# EAGLE schematic stmdc (EAGLE 7.2.0)
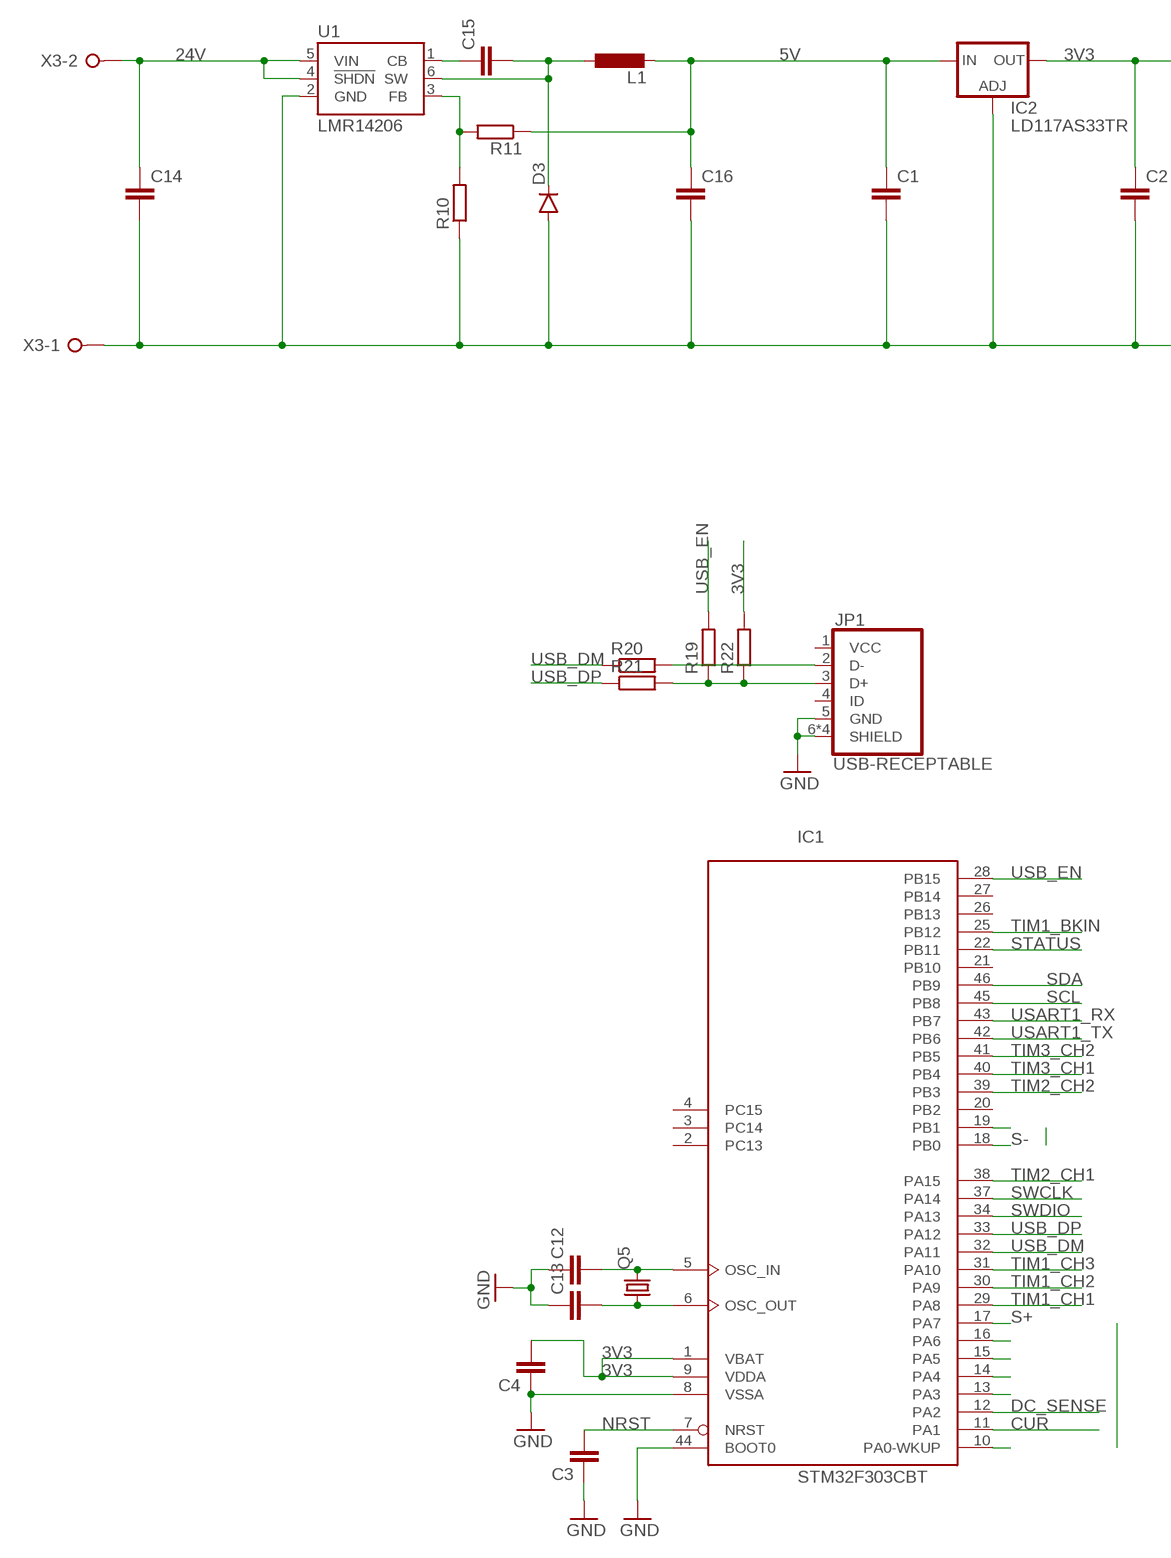
[diagram p0: schematic, sheet 1, part 1 of 2]
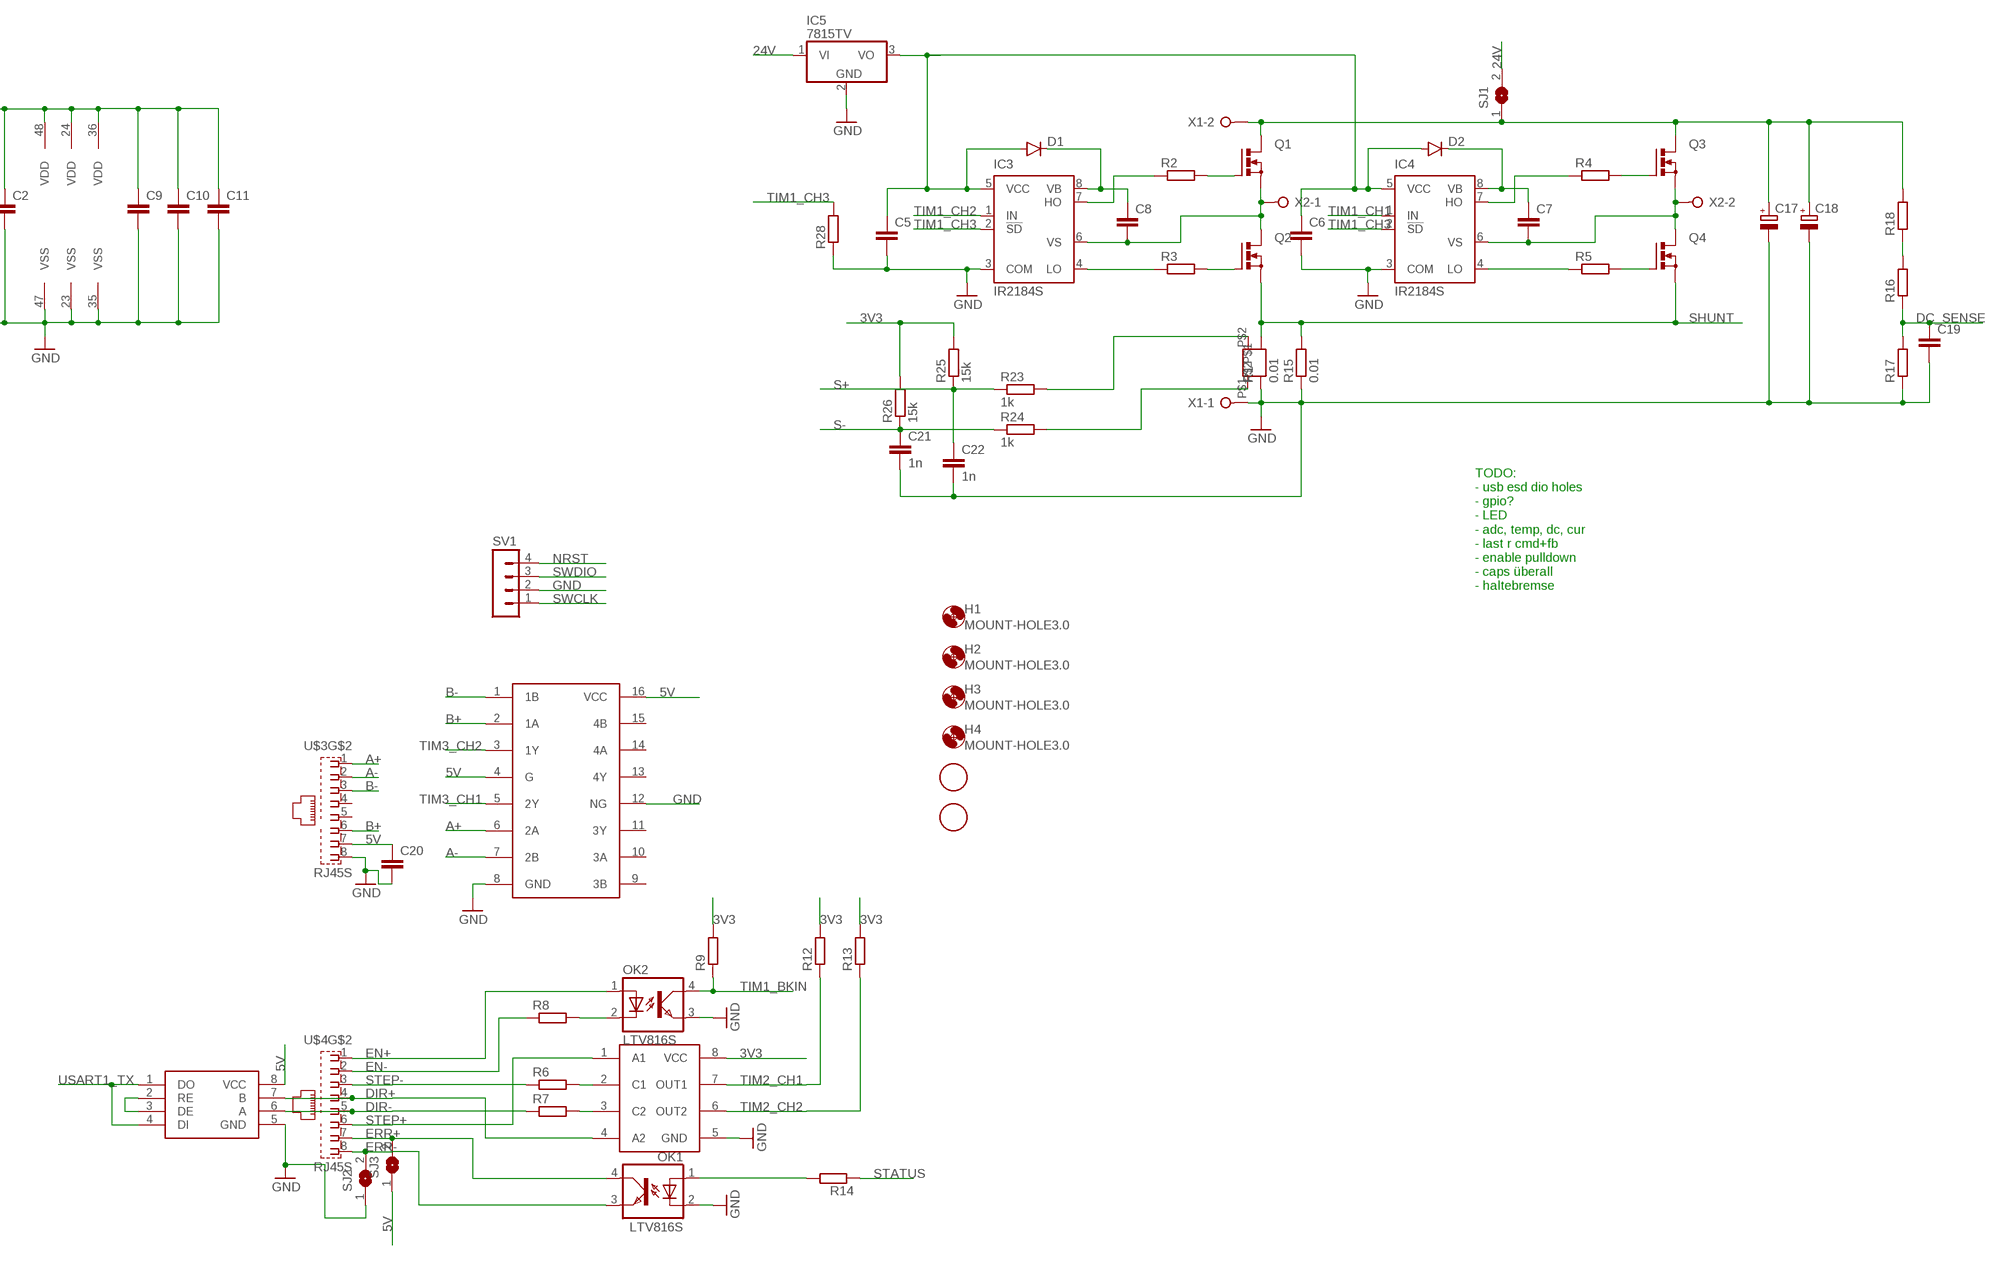
[diagram p1: schematic, sheet 1, part 2 of 2]

## Parts
C1  C-EUC0805  [C0805]
C2  C-EUC0805  [C0805]
C3  C-EUC0603  [C0603]
C4  C-EUC0603  [C0603]
C5  C-EUC0603  [C0603]
C6  C-EUC0603  [C0603]
C7  C-EUC0805  [C0805]
C8  C-EUC0805  [C0805]
C9  C-EUC0603  [C0603]
C10  C-EUC0603  [C0603]
C11  C-EUC0603  [C0603]
C12  C-EUC0603  [C0603]
C13  C-EUC0603  [C0603]
C14  C-EUC1210  [C1210]
C15  C-EUC0805  [C0805]
C16  C-EUC1210  [C1210]
C17  CPOL-EUTT5D11L  [TT5D11L]
C18  CPOL-EUTT5D11L  [TT5D11L]
C19  C-EUC0603  [C0603]
C20  C-EUC0603  [C0603]
C21  1n  C-EUC0603  [C0603]
C22  1n  C-EUC0603  [C0603]
D1  DIODESMA  [SMA-DIODE]
D2  DIODESMA  [SMA-DIODE]
D3  DIODESMA  [SMA-DIODE]
H1  MOUNT-HOLE3.0  [3,0]
H2  MOUNT-HOLE3.0  [3,0]
H3  MOUNT-HOLE3.0  [3,0]
H4  MOUNT-HOLE3.0  [3,0]
IC1  STM32F303CBT  [LQFP48]
IC2  LD117AS33TR  [SOT223]
IC3  IR2184S  [SO08]
IC4  IR2184S  [SO08]
IC5  7815TV  [TO220V]
JP1  USB-RECEPTABLE  [FCI-10103594-0001LF]
L1  L-EUPIS2816  [PIS2816]
OK1  LTV816S  [SMD4]
OK2  LTV816S  [SMD4]
Q1  PMOSFET_NTO220BH  [TO220BH]
Q2  PMOSFET_NTO220BH  [TO220BH]
Q3  PMOSFET_NTO220BH  [TO220BH]
Q4  PMOSFET_NTO220BH  [TO220BH]
Q5  CRYSTALCTS406  [CTS406]
R1  0.01  R-SHUNT  [R2512]
R2  R-EU_R0603  [R0603]
R3  R-EU_R0603  [R0603]
R4  R-EU_R0603  [R0603]
R5  R-EU_R0603  [R0603]
R6  R-EU_R0603  [R0603]
R7  R-EU_R0603  [R0603]
R8  R-EU_R0603  [R0603]
R9  R-EU_R0603  [R0603]
R10  R-EU_R0603  [R0603]
R11  R-EU_R0603  [R0603]
R12  R-EU_R0603  [R0603]
R13  R-EU_R0603  [R0603]
R14  R-EU_R0603  [R0603]
R15  0.01  R-EU_R2512  [R2512]
R16  R-EU_R0805  [R0805]
R17  R-EU_R0603  [R0603]
R18  R-EU_R0805  [R0805]
R19  R-EU_R0603  [R0603]
R20  R-EU_R0603  [R0603]
R21  R-EU_R0603  [R0603]
R22  R-EU_R0603  [R0603]
R23  1k  R-EU_R0603  [R0603]
R24  1k  R-EU_R0603  [R0603]
R25  15k  R-EU_R0603  [R0603]
R26  15k  R-EU_R0603  [R0603]
R28  R-EU_R0603  [R0603]
SJ1  SJ  [SJ]
SJ2  SJ  [SJ]
SJ3  SJ  [SJ]
SV1  MA04-1  [MA04-1]
U1  LMR14206  LMR14206SOT-23  [SOT23-6]
U$1  AM26LS32ACD  [SO16]
U$2  HCPL-053L-SMD  [SO08]
U$3  RJ45S  [RJ45]
U$4  RJ45S  [RJ45]
U$5  FIDUCIAL  [FIDUCIAL_1MM]
U$6  FIDUCIAL  [FIDUCIAL_1MM]
U$7  ADM485SOIC8  [SOIC08]
X1  AKL230-02  [AKL230-02]
X2  AKL230-02  [AKL230-02]
X3  AKL230-02  [AKL230-02]

## Nets
3V3: C2.1 C4.2 C9.1 C10.1 C11.1 IC1.1(VBAT) IC1.9(VDDA) IC1.24(VDD) IC1.36(VDD) IC1.48(VDD) IC2.4(OUT) R9.2 R12.2 R13.2 R22.2 R25.2 R26.2 U$2.8(VCC)
5V: C1.1 C16.1 C20.1 IC2.3(IN) L1.2 R11.1 SJ3.1 U$1.4(G) U$1.16(VCC) U$3.7 U$7.8(VCC)
24V: C14.1 IC5.1(VI) SJ1.2 U1.4(!SHDN) U1.5(VIN) X3.2
A+: U$1.6(2A) U$3.1
A-: U$1.7(2B) U$3.2
B+: U$1.2(1A) U$3.6
B-: U$1.1(1B) U$3.3
CUR: IC1.11(PA1)
DC_SENSE: C19.1 IC1.12(PA2) R16.1 R17.2
DIR+: U$2.4(A2) U$4.4 U$7.7(B)
DIR-: R7.1 U$4.5 U$7.6(A)
EN+: OK2.1(A) U$4.1
EN-: R8.1 U$4.2
ERR+: OK1.4(COL) SJ3.2 U$4.7
ERR-: OK1.3(EMIT) SJ2.2 U$4.8
GND: C1.2 C2.2 C3.1 C4.1 C5.2 C6.2 C9.2 C10.2 C11.2 C12.1 C13.1 C14.2 C16.2 C17.- C18.- C19.2 C20.2 C21.2 C22.2 D3.A IC1.8(VSSA) IC1.23(VSS) IC1.35(VSS) IC1.44(BOOT0) IC1.47(VSS) IC2.1(ADJ) IC3.3(COM) IC4.3(COM) IC5.2(GND) JP1.5(GND) JP1.6(SHIELD) JP1.7(SHIELD) JP1.8(SHIELD) JP1.9(SHIELD) OK1.2(C) OK2.3(EMIT) R1.1 R10.1 R15.1 R17.1 R28.1 SJ2.1 SV1.2 U1.2(GND) U$1.8(GND) U$1.12(NG) U$2.5(GND) U$3.8 U$7.5(GND) X1.1 X3.1
LIN: C15.2 D3.C L1.1 U1.6(SW)
N$1: C8.1 D1.C IC3.8(VB)
N$2: C8.2 IC3.6(VS) Q1.S Q2.D X2.1
N$3: C5.1 C6.1 D1.A D2.A IC3.5(VCC) IC4.5(VCC) IC5.3(VO)
N$4: Q2.G R3.2
N$5: Q1.G R2.2
N$6: IC3.4(LO) R3.1
N$7: IC3.7(HO) R2.1
N$8: C7.2 IC4.6(VS) Q3.S Q4.D X2.2
N$9: C7.1 D2.C IC4.8(VB)
N$10: IC4.7(HO) R4.1
N$11: IC4.4(LO) R5.1
N$12: Q3.G R4.2
N$13: C12.2 IC1.5(OSC_IN) Q5.3
N$14: Q4.G R5.2
N$15: R16.2 R18.1
N$16: C17.+ C18.+ Q1.D Q3.D R18.2 SJ1.1 X1.2
N$17: U$7.2(RE) U$7.3(DE)
N$18: C13.2 IC1.6(OSC_OUT) Q5.1
N$19: R6.2 U$2.2(C1)
N$20: R1.P$2 R23.2
N$21: R7.2 U$2.3(C2)
N$22: OK2.2(C) R8.2
N$23: C15.1 U1.1(CB)
N$24: R1.P$1 R24.2
N$27: R10.2 R11.2 U1.3(FB)
N$28: OK1.1(A) R14.2
N$29: JP1.3(D+) R19.1 R21.2 R22.1
N$30: JP1.2(D-) R20.2
N$33: IC1.19(PB1)
N$37: IC1.16(PA6)
N$38: IC1.15(PA5)
N$39: IC1.14(PA4)
N$40: IC1.13(PA3)
N$43: IC1.10(PA0-WKUP)
NRST: C3.2 IC1.7(NRST) SV1.4
S+: C22.1 IC1.17(PA7) R23.1 R25.1
S-: C21.1 IC1.18(PB0) R24.1 R26.1
SCL: IC1.45(PB8)
SDA: IC1.46(PB9)
SHUNT: Q2.S Q4.S R1.2 R15.2
STATUS: IC1.22(PB11) R14.1
STEP+: U$2.1(A1) U$4.6
STEP-: R6.1 U$4.3
SWCLK: IC1.37(PA14) SV1.1
SWDIO: IC1.34(PA13) SV1.3
TIM1_BKIN: IC1.25(PB12) OK2.4(COL) R9.1
TIM1_CH1: IC1.29(PA8) IC4.1(IN)
TIM1_CH2: IC1.30(PA9) IC3.1(IN)
TIM1_CH3: IC1.31(PA10) IC3.2(!SD) IC4.2(!SD) R28.2
TIM2_CH1: IC1.38(PA15) R12.1 U$2.7(OUT1)
TIM2_CH2: IC1.39(PB3) R13.1 U$2.6(OUT2)
TIM3_CH1: IC1.40(PB4) U$1.5(2Y)
TIM3_CH2: IC1.41(PB5) U$1.3(1Y)
USART1_RX: IC1.43(PB7)
USART1_TX: IC1.42(PB6) U$7.1(DO) U$7.4(DI)
USB_DM: IC1.32(PA11) R20.1
USB_DP: IC1.33(PA12) R21.1
USB_EN: IC1.28(PB15) R19.2
Unconnected: IC1.2(PC13) IC1.3(PC14) IC1.4(PC15) IC1.20(PB2) IC1.21(PB10) IC1.26(PB13) IC1.27(PB14) JP1.1(VCC) JP1.4(ID) U$1.9(3B) U$1.10(3A) U$1.11(3Y) U$1.13(4Y) U$1.14(4A) U$1.15(4B) U$3.4 U$3.5 U$3.G3(SHIELD1) U$3.G4(SHIELD2) U$4.G3(SHIELD1) U$4.G4(SHIELD2)

## Notes on the sheet
- TODO:
  - usb esd dio holes
  - gpio?
  - LED
  - adc, temp, dc, cur
  - last r cmd+fb
  - enable pulldown
  - caps überall
  - haltebremse

## Library data of the parts
C1-C16 C19-C22 = rcl:C-EU: CAPACITOR, European symbol
C17 C18 = rcl:CPOL-EU: POLARIZED CAPACITOR, European symbol
D1-D3 = SparkFun-DiscreteSemi:DIODE: Diode These are standard reverse protection diodes and small signal diodes. SMA package can handle up to about 1A. SOD-323 can handle about 200mA. What the SOD-323 package when ordering, there are some mfgs out there that are 5-pin packages.
H1-H4 = holes:MOUNT-HOLE: MOUNTING HOLE with drill center marker
IC1 = micro-stm_v2:STM32F303C*T: ARM 32-bit Cortex™-M3 CPU 72 MHz maximum frequency 128 to 256 Kbytes of Flash memory 32 to 40 kbytes of SRAM 37 GPIOs 2.0 to 3.6 V application supply
IC2 = v-reg:LD117A?*: Low drop fixed and adjustable positive voltage regulators 1 A Source: http://www.st.com/stonline/products/literature/ds/7194/ld1117axx.pdf
IC3 IC4 = IR2184:IR2184: HALF-BRIDGE DRIVER www.irf.com Data Sheet No. PD60174 revG Features *Floating channel designed for bootstrap operation Fully operational to +600V *Tolerant to negative transient voltage dV/dt immune * Gate drive supply range from 10 to 20V * Undervoltage lockout for both channels * 3.3V and 5V input logic compatible * Matched propagation delay for both channels * Logic and power ground +/- 5V offset. * Lower di/dt gate driver for better noise immunity * Output source/sink current capability 1.4A/1.8A * Also available LEAD-FREE (PbF); MF: INTERNATIONAL RECTIFIER(IR); MPN: IR2184
IC5 = linear:78*: Positive VOLTAGE REGULATOR Source: http://cache.national.com/ds/LM/LM78L05.pdf http://www.fairchildsemi.com/ds/LM/LM7805.pdf
JP1 = reroolib:USB-RECEPTABLE: USB Receptable
L1 = rcl:L-EU: INDUCTOR, European symbol
OK1 OK2 = optocoupler:LTV816: OPTO COUPLER Source: LITEON, LTV816.pdf; OC_FARNELL: unknown; OC_NEWARK: unknown
Q1-Q4 = transistor-power:PMOSFET_N: Power MOSFET N-Channel
Q5 = crystal:CRYSTAL: CRYSTAL; OC_FARNELL: unknown; OC_NEWARK: unknown
R1 = reroolib:R-SHUNT
R2-R26 R28 = rcl:R-EU_: RESISTOR, European symbol
SJ1-SJ3 = jumper:SJ: SMD solder JUMPER
SV1 = con-lstb:MA04-1: PIN HEADER; OC_FARNELL: unknown; OC_NEWARK: unknown
U1 = reroolib:LMR14206
U$1 = reroolib:AM26LS32
U$2 = reroolib:HCPL-053L-SMD
U$3 U$4 = reroolib:RJ45S
U$5 U$6 = adafruit:FIDUCIAL: For use by pick and place machines to calibrate the vision/machine, 1mm By microbuilder.eu
U$7 = reroolib:ADM485
X1-X3 = reroolib:AKL230-02: WAGO SREW CLAMP; OC_FARNELL: unknown; OC_NEWARK: unknown